# EAGLE schematic ESP32 SMD CH340G (EAGLE 9.6.2)
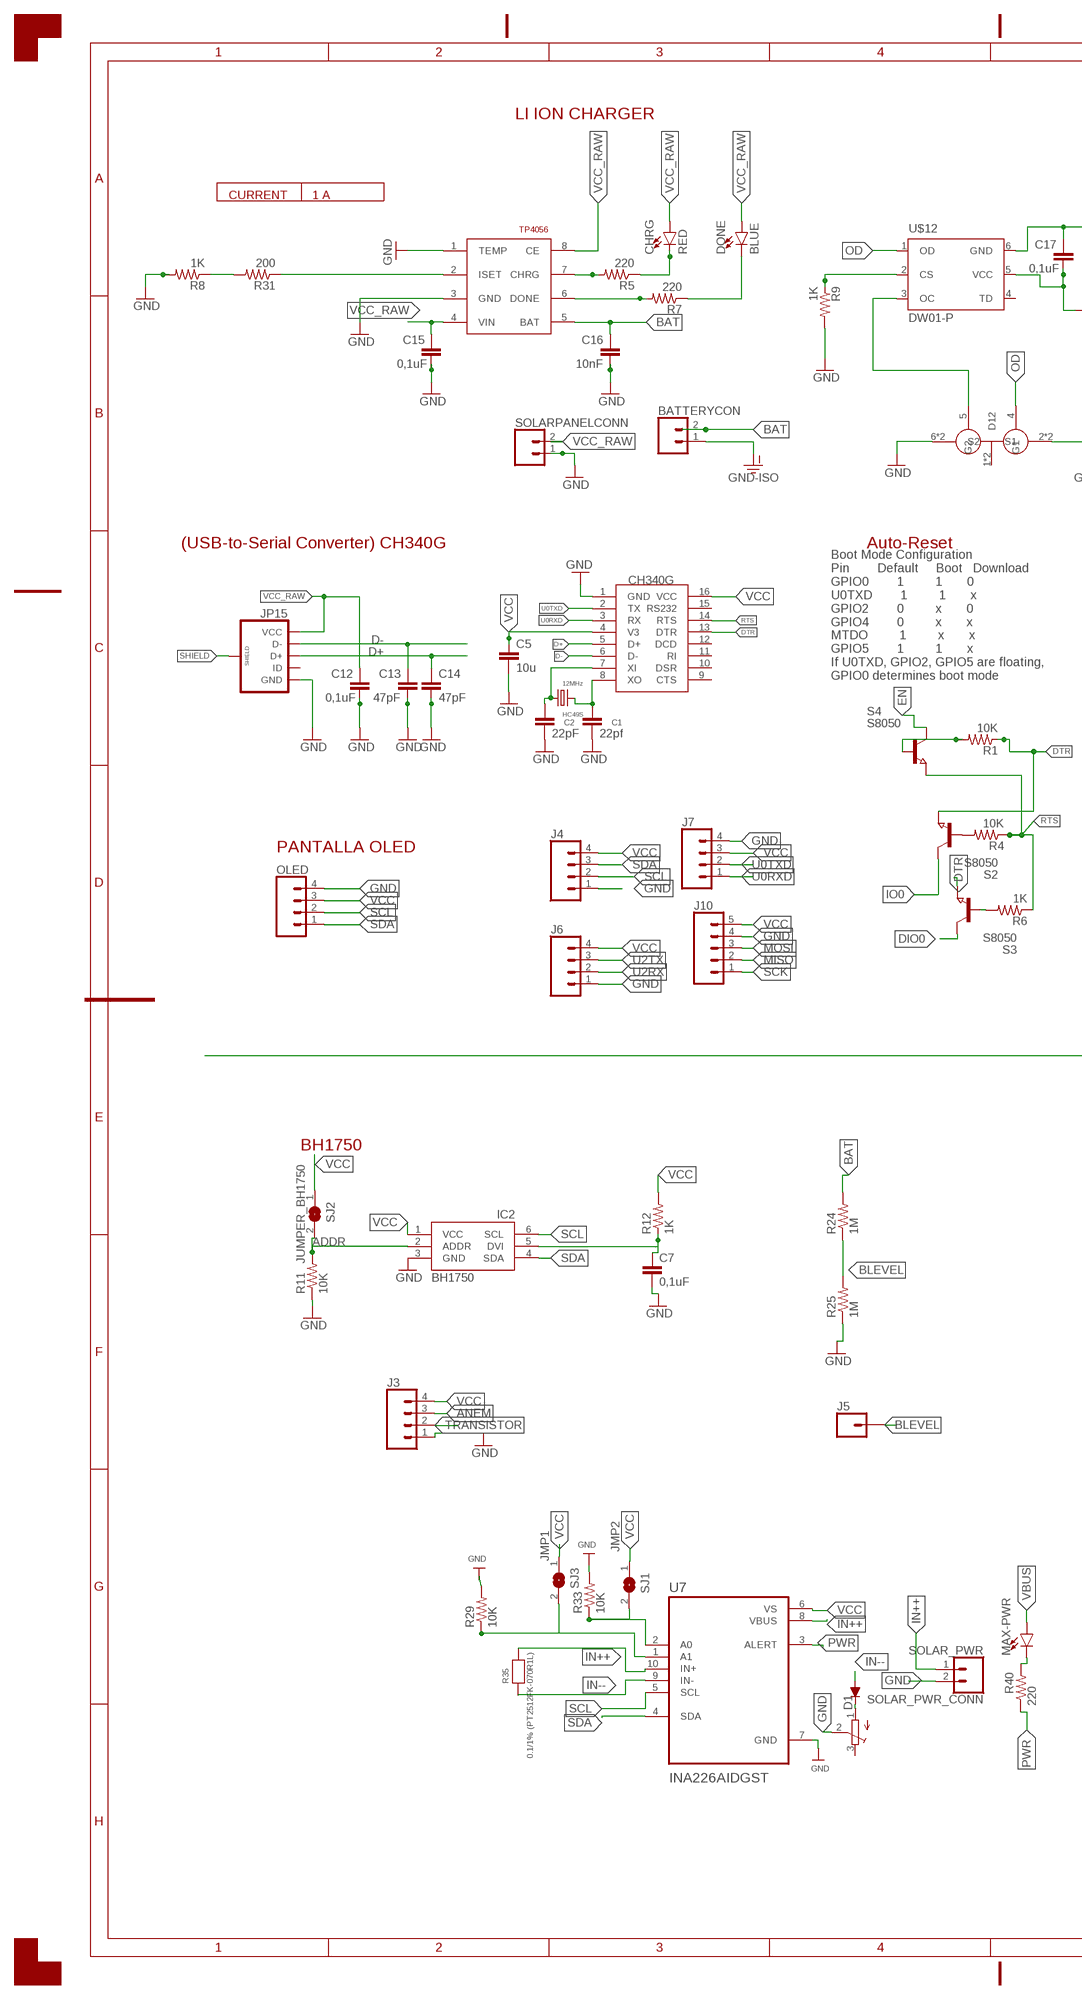
[diagram p0: schematic, sheet 1, part 1 of 2]
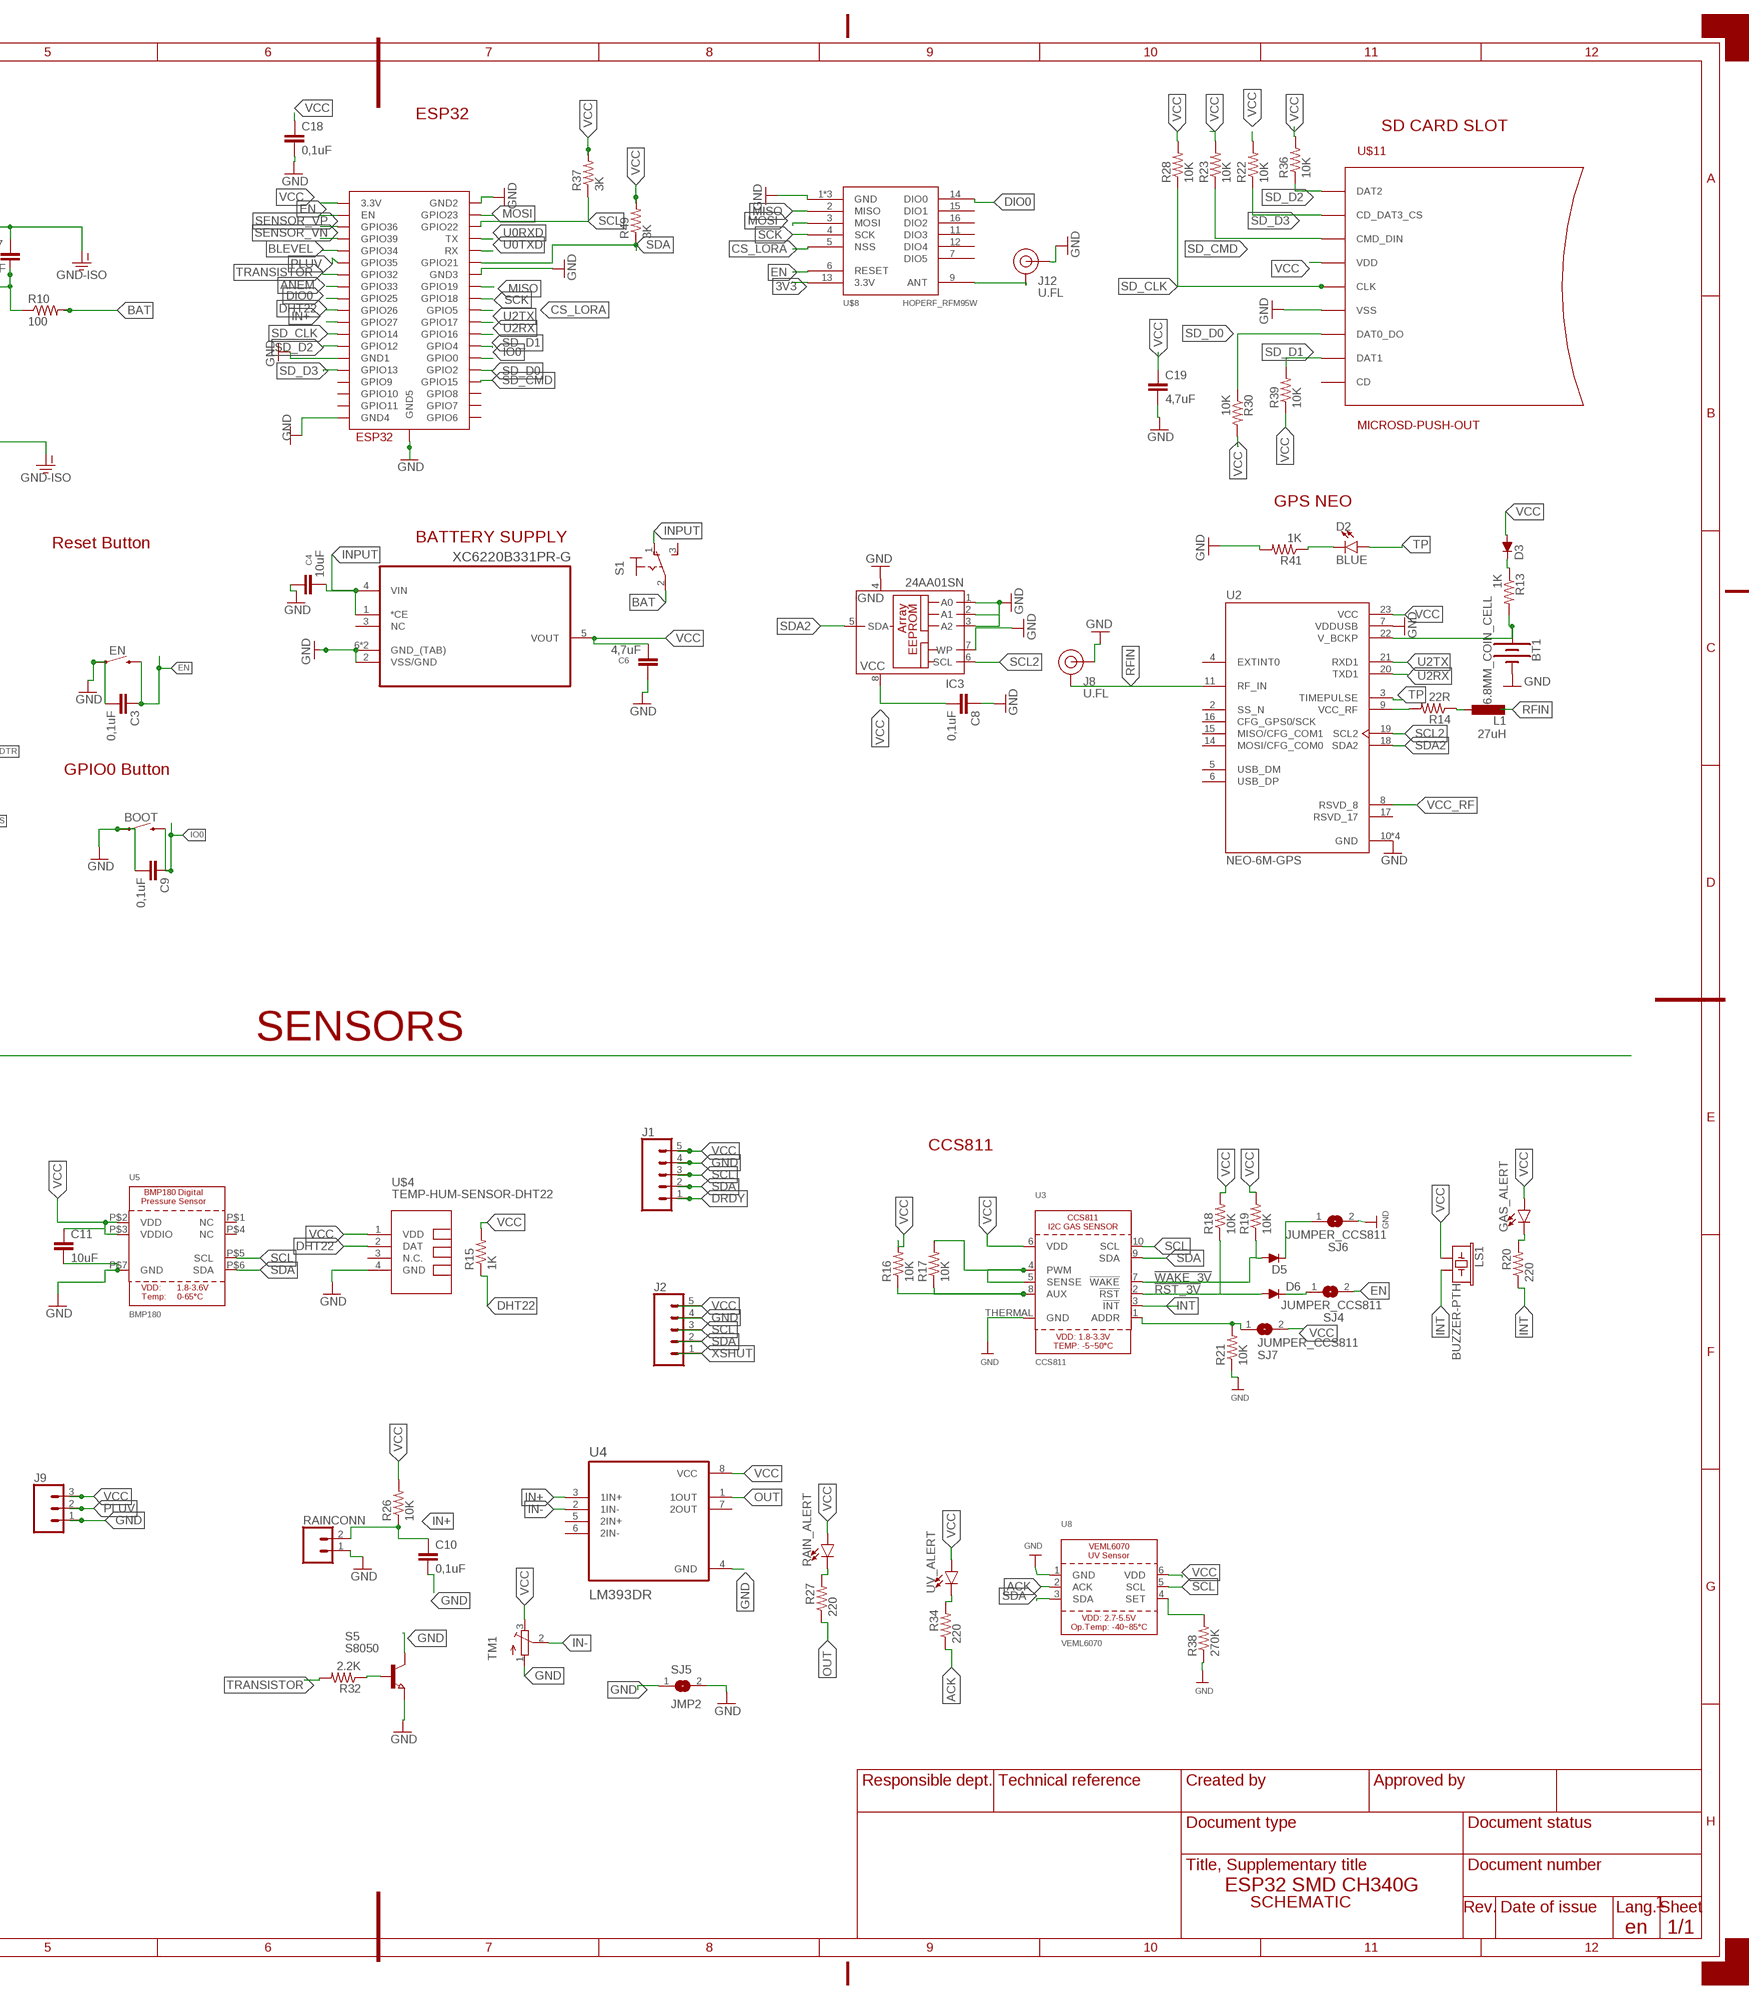
[diagram p1: schematic, sheet 1, part 2 of 2]
FRAME2 (A2_L_DOCFIELD_EN): LANGUAGE: en

## Parts
8205A  FS8205A  [TSSOP8]
BATTERYCON  CONN_02-JST-2-PTH-NO_SILK  [JST-2-PTH-NS]
BOOT  EN  MOMENTARY-SWITCH-SPST-SMD-6.0X3.5MM  [TACTILE_SWITCH_SMD_6.0X3.5MM]
BT1  6.8MM_COIN_CELL  BATTERY-6.8MM_SMD  [BATTCON-6.8MM]
C1  22pf  C-EUC0603  [C0603]
C2  22pF  C-EUC0603  [C0603]
C3  0,1uF  C-EUC0603  [C0603]
C4  10uF  C-EUC0603  [C0603]
C5  10u  C-EUC0603  [C0603]
C6  4,7uF  C-EUC0603  [C0603]
C7  0,1uF  C-EUC0603  [C0603]
C8  0,1uF  C-EUC0603  [C0603]
C9  0,1uF  C-EUC0603  [C0603]
C10  0,1uF  C-EUC0603  [C0603]
C11  10uF  C-EUC0603  [C0603]
C12  0,1uF  C-EUC0603  [C0603]
C13  47pF  C-EUC0603  [C0603]
C14  47pF  C-EUC0603  [C0603]
C15  0,1uF  C-EUC0603  [C0603]
C16  10nF  C-EUC0603  [C0603]
C17  0,1uF  C-EUC0603  [C0603]
C18  0,1uF  C-EUC0603  [C0603]
C19  4,7uF  C-EUC0603  [C0603]
CHRG  RED  LED-RED0603  [LED-0603]
D1  DIODE_DIODE-SOD123  [DIODE_SOD123]
D2  BLUE  LED-BLUE0603  [LED-0603]
D3  DIODE_DIODE-SOD123  [DIODE_SOD123]
D5  DIODE_DIODE-SOD123  [DIODE_SOD123]
D6  DIODE_DIODE-SOD123  [DIODE_SOD123]
DONE  BLUE  LED-BLUE0603  [LED-0603]
EN  RESET  MOMENTARY-SWITCH-SPST-SMD-6.0X3.5MM  [TACTILE_SWITCH_SMD_6.0X3.5MM]
GAS_ALERT  LED-3MM-NO_SILK  [LED_3MM-NS]
HC49S  12MHz  CRYSTALHC49S  [HC49/S]
IC2  BH1750  [WSOF-6]
IC3  24AA01SN  [SO-08]
J1  CONN_05JST-VERT  [JST-5-PTH-VERT]
J2  CONN_05JST-VERT  [JST-5-PTH-VERT]
J3  CONN_04JST-PTH-VERT  [JST-4-PTH-VERT]
J4  CONN_04  [1X04]
J5  CONN_01  [1X01]
J6  CONN_04  [1X04]
J7  CONN_04  [1X04]
J8  U.FL  U.FL2PIN  [U.FL]
J9  CONN_03JST-PTH-VERT  [JST-3-PTH-VERT]
J10  CONN_05JST-VERT  [JST-5-PTH-VERT]
J12  U.FL  U.FL2PIN  [U.FL]
JP15  USB_MICROB_PLUGCONN-11752  [USB-B-MICRO-SMD_V03]
L1  27uH  L-EUL3216C  [L3216C]
LS1  BUZZER-PTH  [BUZZER-12MM]
MAX-PWR  LED-3MM-NO_SILK  [LED_3MM-NS]
OLED  CONN_04  [1X04]
R1  10K  R-US_R0603  [R0603]
R4  10K  R-US_R0603  [R0603]
R5  220  R-US_R0603  [R0603]
R6  1K  R-US_R0603  [R0603]
R7  220  R-US_R0603  [R0603]
R8  1K  R-US_R0603  [R0603]
R9  1K  R-US_R0603  [R0603]
R10  100  R-US_R0603  [R0603]
R11  10K  R-US_R0603  [R0603]
R12  1K  R-US_R0603  [R0603]
R13  1K  R-US_R0603  [R0603]
R14  22R  R-US_R0603  [R0603]
R15  1K  R-US_R0603  [R0603]
R16  10K  R-US_R0603  [R0603]
R17  10K  R-US_R0603  [R0603]
R18  10K  R-US_R0603  [R0603]
R19  10K  R-US_R0603  [R0603]
R20  220  R-US_R0603  [R0603]
R21  10K  R-US_R0603  [R0603]
R22  10K  R-US_R0603  [R0603]
R23  10K  R-US_R0603  [R0603]
R24  1M  R-US_R0603  [R0603]
R25  1M  R-US_R0603  [R0603]
R26  10K  R-US_R0603  [R0603]
R27  220  R-US_R0603  [R0603]
R28  10K  R-US_R0603  [R0603]
R29  10K  R-US_R0603  [R0603]
R30  10K  R-US_R0603  [R0603]
R31  200  R-US_R0603  [R0603]
R32  2.2K  R-US_R0603  [R0603]
R33  10K  R-US_R0603  [R0603]
R34  220  R-US_R0603  [R0603]
R35  0.1/1% (PT2512FK-070R1L)  RESISTOR2512  [2512]
R36  10K  R-US_R0603  [R0603]
R37  3K  R-US_R0603  [R0603]
R38  270K  R-US_R0603  [R0603]
R39  10K  R-US_R0603  [R0603]
R40  220  R-US_R0603  [R0603]
R41  1K  R-US_R0603  [R0603]
R49  3K  R-US_R0603  [R0603]
RAIN_ALERT  LED-3MM-NO_SILK  [LED_3MM-NS]
RAINCONN  CONN_02-JST-2-PTH-NO_SILK  [JST-2-PTH-NS]
S1  320-916  [320-916]
S2  S8050  NPN-TRANSISTOR_SOT23  [SOT23]
S3  S8050  NPN-TRANSISTOR_SOT23  [SOT23]
S4  S8050  NPN-TRANSISTOR_SOT23  [SOT23]
S5  S8050  NPN-TRANSISTOR_SOT23  [SOT23]
SJ1  JMP2  SOLDERJUMPERREFLOW_NOPASTE  [SOLDERJUMPER_REFLOW_NOPASTE]
SJ2  JUMPER_BH1750  SOLDERJUMPERREFLOW_NOPASTE  [SOLDERJUMPER_REFLOW_NOPASTE]
SJ3  JMP1  SOLDERJUMPERREFLOW_NOPASTE  [SOLDERJUMPER_REFLOW_NOPASTE]
SJ4  JUMPER_CCS811  SOLDERJUMPERREFLOW_NOPASTE  [SOLDERJUMPER_REFLOW_NOPASTE]
SJ5  JMP2  SOLDERJUMPERREFLOW_NOPASTE  [SOLDERJUMPER_REFLOW_NOPASTE]
SJ6  JUMPER_CCS811  SOLDERJUMPERREFLOW_NOPASTE  [SOLDERJUMPER_REFLOW_NOPASTE]
SJ7  JUMPER_CCS811  SOLDERJUMPERREFLOW_NOPASTE  [SOLDERJUMPER_REFLOW_NOPASTE]
SOLAR_PWR_CONN  SOLAR_PWR  CONN_02-JST-2-PTH-NO_SILK  [JST-2-PTH-NS]
SOLARPANELCONN  CONN_02-JST-2-PTH-NO_SILK  [JST-2-PTH-NS]
TM1  TRIMPOTTC33X  [TC33X]
TM2  TRIMPOTTC33X  [TC33X]
TP4056  DIO5158  [SOIC-8]
U1  CH340G  [SOIC16]
U2  NEO-6M-GPS  [XCVR_NEO-6M-GPS]
U3  CCS811  [CCS811]
U4  LM393DR  [SOIC127P599X175-8N]
U5  BMP180  BMP180EXT  [BMP180_EXTENDED]
U7  INA226AIDGST  [SOP50P490X110-10N]
U8  VEML6070  UV_VEML6070  [VEML6070]
U$1  ESP32-WROOM  [ESP32-WROOM]
U$4  TEMP-HUM-SENSOR-DHT22  [TEMP-HUM-SENSOR-DHT22]
U$8  HOPERF_RFM95W  [HOPERF_RFM95W]
U$11  MICROSD-PUSH-OUT  [MICROSD-PUSH-OUT]
U$12  DW01-P  [SOT23-6L]
UV_ALERT  LED-3MM-NO_SILK  [LED_3MM-NS]
XC6220B331PR-G  XC6210B332PR  [XC6210B332PR]

## Nets
3V3: U$8.13(3.3V)
!RST_3V: D6.A R18.1 U3.2(!RST)
!WAKE_3V: D5.A R19.1 U3.7(!WAKE)
ACK: R34.1 U8.2(ACK)
ADDR: IC2.2(ADDR) R11.2 SJ2.2
ANEM: J3.3 U$1.IO33(GPIO33)
BAT: BATTERYCON.2 C16.1 R10.2 R24.2 S1.2(P) TP4056.5(BAT)
BLEVEL: J5.1 R24.1 R25.2 U$1.IO34(GPIO34)
CHRG: R5.2 TP4056.7(CHRG)
CS_LORA: U$1.IO5(GPIO5) U$8.5(NSS)
D+: C14.1 JP15.D+ U1.5(D+)
D-: C13.1 JP15.D- U1.6(D-)
DHT22: R15.1 U$1.IO26(GPIO26) U$4.2(DAT)
DIO0: S3.3(C) U$1.IO25(GPIO25) U$8.14(DIO0)
DONE: R7.2 TP4056.6(DONE)
DRDY: J1.1
DTR: R1.1 S2.2(E) S3.2(E) U1.13(DTR)
EN: C3.1 EN.2 S4.3(C) SJ4.2 U$1.EN U$8.6(RESET)
GND [GND]: 8205A.6(S2) 8205A.7(S2) BOOT.1 BT1.- C1.2 C2.2 C3.2 C4.1 C5.2 C6.1 C7.2 C8.1 C9.2 C10.2 C11.2 C12.2 C13.2 C14.2 C15.2 C16.2 C18.2 C19.2 EN.1 IC2.3(GND) IC3.1(A0) IC3.2(A1) IC3.3(A2) IC3.4(GND) IC3.7(WP) J1.4 J2.4 J3.1 J4.1 J6.1 J7.4 J8.FEED(SIGNAL) J9.1 J10.4 J12.FEED(SIGNAL) JP15.GND OLED.4 R8.2 R9.2 R11.1 R21.1 R25.1 R29.2 R33.2 R38.1 R41.2 RAINCONN.1 S5.2(E) S5.3(C) SJ5.1 SJ5.2 SJ6.2 SOLAR_PWR_CONN.2 SOLARPANELCONN.1 TM1.1(A) TM2.2(S) TP4056.1(TEMP) TP4056.3(GND) U1.1(GND) U2.7(VDDUSB) U2.10(GND) U2.12(GND) U2.13(GND) U2.24(GND) U3.THERMAL(GND) U4.4(GND) U5.P$7(GND) U7.7(GND) U8.1(GND) U$1.GND1 U$1.GND2 U$1.GND3 U$1.GND4 U$1.GND5 U$4.4(GND) U$8.1(GND) U$8.8(GND) U$8.10(GND) U$11.6(VSS) U$11.G1(VSS) U$11.G2(VSS) U$11.G3(VSS) U$11.G4(VSS) XC6220B331PR-G.2(VSS/GND) XC6220B331PR-G.6(GND_(TAB)) XC6220B331PR-G.TAB(GND_(TAB))
GND-ISO: 8205A.2(S1) 8205A.3(S1) BATTERYCON.1 C17.1 U$12.6(GND)
IN+: C10.1 R26.1 RAINCONN.2 U4.3(1IN+) U$1.IO27(GPIO27)
IN++: R35.2 SOLAR_PWR_CONN.1 U7.8(VBUS) U7.10(IN+)
IN-: TM1.2(S) U4.2(1IN-)
IN--: D1.A R35.1 U7.9(IN-)
INPUT: C4.2 S1.1(O) XC6220B331PR-G.1(*CE) XC6220B331PR-G.4(VIN)
INT: LS1.- R20.1 U3.3(!INT)
IO0: BOOT.2 C9.1 S2.3(C) U$1.IO0(GPIO0)
ISET: R31.1 TP4056.2(ISET)
LED1: CHRG.C R5.1
LED2: DONE.C R7.1
MISO: J10.2 U$1.IO19(GPIO19) U$8.2(MISO)
MOSI: J10.3 U$1.IO23(GPIO23) U$8.3(MOSI)
N$1: C1.1 HC49S.2 U1.8(XO)
N$2: C2.1 HC49S.1 U1.7(XI)
N$3: R4.2 S2.1(B)
N$4: R14.2 U2.9(VCC_RF)
N$5: R1.2 S4.1(B)
N$6: L1.1 R14.1
N$8: D3.C R13.1
N$9: R16.1 R17.1 U3.8(AUX)
N$10: GAS_ALERT.K(C) R20.2
N$11: R21.2 SJ7.1 U3.1(ADDR)
N$12: R27.2 RAIN_ALERT.K(C)
N$14: R6.2 S3.1(B)
N$15: D5.C SJ6.1
N$16: D6.C SJ4.1
N$17: R38.2 U8.4(SET)
N$18: D1.C TM2.1(A)
N$19: R33.1 SJ1.2 U7.2(A0)
N$20: R29.1 SJ3.2 U7.1(A1)
N$21: R34.2 UV_ALERT.K(C)
N$22: R8.1 R31.2
N$23: R32.1 S5.1(B)
N$24: MAX-PWR.K(C) R40.2
N$25: D2.C R41.1
N$26: J12.1(GND) J12.2(GND) U$8.9(ANT)
N$75: BT1.+ R13.2 U2.22(V_BCKP)
N$97: C7.1 IC2.5(DVI) R12.1
N$98: R17.2 U3.4(PWM) U3.5(SENSE)
N$104: R9.1 U$12.2(CS)
N$105: 8205A.5(G2) U$12.3(OC)
OD: 8205A.4(G1) U$12.1(OD)
OUT: R27.1 U4.1(1OUT)
PLUV: J9.2 U$1.IO35(GPIO35)
PWR: R40.1 U7.3(ALERT)
RFIN: J8.1(GND) J8.2(GND) L1.2 U2.11(RF_IN)
RTS: R4.1 R6.1 S4.2(E) U1.14(RTS)
SCK: J10.1 U$1.IO18(GPIO18) U$8.4(SCK)
SCL: IC2.6(SCL) J1.3 J2.3 J4.2 OLED.2 R37.1 U3.10(SCL) U5.P$5(SCL) U7.5(SCL) U8.5(SCL) U$1.IO22(GPIO22)
SCL2: IC3.6(SCL) U2.19(SCL2)
SD_CLK: R28.1 U$1.IO14(GPIO14) U$11.5(CLK)
SD_CMD: R23.1 U$1.IO15(GPIO15) U$11.3(CMD_DIN)
SD_D0: R30.1 U$1.IO2(GPIO2) U$11.7(DAT0_DO)
SD_D1: R39.2 U$1.IO4(GPIO4) U$11.8(DAT1)
SD_D2: R36.1 U$1.IO12(GPIO12) U$11.1(DAT2)
SD_D3: R22.1 U$1.IO13(GPIO13) U$11.2(CD_DAT3_CS)
SDA: IC2.4(SDA) J1.2 J2.2 J4.3 OLED.1 R49.1 U3.9(SDA) U5.P$6(SDA) U7.4(SDA) U8.3(SDA) U$1.IO21(GPIO21)
SDA2: IC3.5(SDA) U2.18(SDA2)
SENSOR_VN: U$1.SENSOR_VN(GPIO39)
SENSOR_VP: U$1.SENSOR_VP(GPIO36)
SHIELD: JP15.SHIELD1(SHIELD) JP15.SHIELD2(SHIELD) JP15.SHIELD3(SHIELD)
TP: D2.A U2.3(TIMEPULSE)
TRANSISTOR: J3.2 R32.2 U$1.IO32(GPIO32)
U0RXD: J7.1 U1.3(RX) U$1.TX
U0TXD: J7.2 U1.2(TX) U$1.RX
U2RX: J6.2 U2.20(TXD1) U$1.IO16(GPIO16)
U2TX: J6.3 U2.21(RXD1) U$1.IO17(GPIO17)
VBUS: MAX-PWR.A
VCC: C5.1 C6.2 C8.2 C11.1 C18.1 C19.1 D3.A GAS_ALERT.A IC2.1(VCC) IC3.8(VCC) J1.5 J2.5 J3.4 J4.4 J6.4 J7.3 J9.3 J10.5 LS1.+ OLED.3 R12.2 R15.2 R16.2 R18.2 R19.2 R22.2 R23.2 R26.2 R28.2 R30.2 R36.2 R37.2 R39.1 R49.2 RAIN_ALERT.A SJ1.1 SJ2.1 SJ3.1 SJ7.2 TM1.3(E) U1.4(V3) U1.16(VCC) U2.23(VCC) U3.6(VDD) U4.8(VCC) U5.P$2(VDD) U5.P$3(VDDIO) U7.6(VS) U8.6(VDD) U$1.3V3(3.3V) U$4.1(VDD) U$11.4(VDD) UV_ALERT.A XC6220B331PR-G.5(VOUT)
VCC-DW: C17.2 R10.1 U$12.5(VCC)
VCC_RAW: C12.1 C15.1 CHRG.A DONE.A JP15.VBUS(VCC) SOLARPANELCONN.2 TP4056.4(VIN) TP4056.8(CE)
VCC_RF: U2.8(RSVD_8)
XSHUT: J2.1
Unconnected: 8205A.1(D12) 8205A.8(D12) JP15.ID S1.3(S) TM2.3(E) U1.9(CTS) U1.10(DSR) U1.11(RI) U1.12(DCD) U1.15(RS232) U2.2(SS_N) U2.4(EXTINT0) U2.5(USB_DM) U2.6(USB_DP) U2.14(MOSI/CFG_COM0) U2.15(MISO/CFG_COM1) U2.16(CFG_GPS0/SCK) U2.17(RSVD_17) U4.5(2IN+) U4.6(2IN-) U4.7(2OUT) U5.P$1(NC) U5.P$4(NC) U$1.CLK(GPIO6) U$1.CMD(GPIO11) U$1.SD0(GPIO7) U$1.SD1(GPIO8) U$1.SD2(GPIO9) U$1.SD3(GPIO10) U$4.3(N.C.) U$8.7(DIO5) U$8.11(DIO3) U$8.12(DIO4) U$8.15(DIO1) U$8.16(DIO2) U$11.CD U$12.4(TD) XC6220B331PR-G.3(NC)

## Notes on the sheet
- LI ION CHARGER | ESP32
- SD CARD SLOT
- CURRENT | 1 A
- GPS NEO
- BATTERY SUPPLY
- (USB-to-Serial Converter) CH340G | Auto-Reset | Reset Button
- Boot Mode Configuration
  Pin        Default     Boot   Download
  GPIO0        1         1       0
  U0TXD        1         1       x
  GPIO2        0         x       0
  GPIO4        0         x       x
  MTDO         1         x       x
  GPIO5        1         1       x
  If U0TXD, GPIO2, GPIO5 are floating, 
  GPIO0 determines boot mode
- GPIO0 Button
- PANTALLA OLED
- SENSORS
- BH1750 | CCS811
- SCHEMATIC | 1

## Library data of the parts
8205A = SparkFun:FS8205A
BATTERYCON RAINCONN SOLAR_PWR_CONN SOLARPANELCONN = SparkFun-Connectors:CONN_02: Multi connection point. Often used as Generic Header-pin footprint for 0.1 inch spaced/style header connections On any of the 0.1 inch spaced packages, you can populate with these: Break Away Headers - Straight <https://www.sparkfun.com/products/116> (PRT-00116) Break Away Male Headers - Right Angle <https://www.sparkfun.com/products/553> (PRT-00553) Female Headers <https://www.sparkfun.com/products/115> (PRT-00115) Break Away Headers - Machine Pin <https://www.sparkfun.com/products/117> (PRT-00117) Break Away Female Headers - Swiss Machine Pin <https://www.sparkfun.com/products/743> (PRT-00743) For SCREWTERMINALS and SPRING TERMINALS visit here: Screw Terimnals on SparkFun.com <https://www.sparkfun.com/search/results?term=Screw+Terminals> (5mm/3.5mm/2.54mm spacing) This device is also useful as a general connection point to wire up your design to another part of your project. Our various solder wires solder well into these plated through hole pads. Hook-Up Wire - Assortment (Stranded, 22 AWG) <https://www.sparkfun.com/products/11375> (PRT-11375) Hook-Up Wire - Assortment (Solid Core, 22 AWG) <https://www.sparkfun.com/products/11367> (PRT-11367) View the entire wire category on our website here <https://www.sparkfun.com/categories/141> Special notes: Molex polarized connector foot print use with: PRT-08233 with associated crimp pins and housings. 2.54_SCREWTERM for use with PRT-10571. 3.5mm Screw Terminal footprints for PRT-08084 5mm Screw Terminal footprints for use with PRT-08432
BOOT EN = SparkFun-Switches:MOMENTARY-SWITCH-SPST: Momentary Switch (Pushbutton) - SPST Normally-open (NO) SPST momentary switches (buttons, pushbuttons). Variants PTH-12MM - 12mm square, through-hole Momentary Pushbutton Switch - 12mm Square <https://www.sparkfun.com/products/9190> (COM-09190) PTH-6.0MM, PTH-6.0MM-KIT - 6.0mm square, through-hole Mini Pushbutton Switch <https://www.sparkfun.com/products/97> (COM-00097) KIT package intended for soldering kit's - only one side of pads' copper is exposed. PTH-RIGHT-ANGLE-KIT - Right-angle, through-hole Right Angle Tactile Button <https://www.sparkfun.com/products/10791> - Used on SparkFun BigTime Watch Kit <https://www.sparkfun.com/products/11734> SMD-12MM - 12mm square, surface-mount Tactile Button - SMD (12mm) <https://www.sparkfun.com/products/12993> (COM-12993) Used on SparkFun PicoBoard <https://www.sparkfun.com/products/11888> SMD-4.5MM - 4.5mm Square Trackball Switch Used on SparkFun Blackberry Trackballer Breakout <https://www.sparkfun.com/products/13169> SMD-4.6MMX2.8MM - 4.60mm x 2.80mm, surface mount Used on SparkFun SAMD21 Mini Breakout <https://www.sparkfun.com/products/13664> SMD-5.2MM, SMD-5.2-REDUNDANT - 5.2mm square, surface-mount Mini Pushbutton Switch - SMD <https://www.sparkfun.com/products/8720> (COM-08720) Used on Arduino Pro Mini <https://www.sparkfun.com/products/11114> REDUNDANT package connects both switch circuits together SMD-6.0X3.5MM - 6.0 x 3.5mm, surface mount Momentary Reset Switch SMD <https://www.sparkfun.com/products/8229> (COM-08229) SMD-6.2MM-TALL - 6.2mm square, surface mount Tactile Button - SMD (6mm) <https://www.sparkfun.com/products/12992> Used on SparkFun Digital Sandbox <https://www.sparkfun.com/products/12651> SMD-RIGHT-ANGLE - Right-angle, surface mount Used on SparkFun Block for Intel® Edison - Arduino <https://www.sparkfun.com/products/13036>; PROD_ID: SWCH-00815; SF_SKU: COM-08229
BT1 = SparkFun-Batteries:BATTERY: Battery - Single Cell A variety of battery chemistries, sizes, and footprints. Device List: 20MM_PTH - Coin Cell Battery Holder - 20mm (PTH) <https://www.sparkfun.com/products/783> 6.8MM_PTH - Coin Cell Battery Holder - 6.8MM(SMD) <https://www.digikey.com/product-detail/en/seiko-instruments/MS621FE-FL11E/728-1057-ND/1889208?WT.srch=1&gclid=CNOQ5a6LzdQCFZS2wAodXCkE0g> 12MM_SMD - Coin Cell Battery Holder - 12mm (SMD) <https://www.sparkfun.com/products/10592> 12MM_PTH - Coin Cell Battery Holder - 12mm (PTH) <https://www.sparkfun.com/products/7948> 20MM_SMD - 20mm Coin Cell Battery Holder (SMD) (2 legs) Used on the Big Time Watch Kit <https://www.sparkfun.com/products/11734> 20MM_SMD_4LEGS - Coin Cell Battery Holder - 20mm (SMD) <https://www.sparkfun.com/products/11892> 20MM_SMD_4LEGS_OVERPASTE - Coin Cell Battery Holder - 20mm (SMD) <https://www.sparkfun.com/products/11892> (Over-paste on the legs) 24.5MM_PTH - Coin Cell Battery Holder - 24.5mm (PTH) <https://www.sparkfun.com/products/8863> 9V - 9V Battery Holder - PC Mount Used on the SparkFun SparkPunk Sound Kit <https://www.sparkfun.com/products/11177> and SparkFun SparkPunk Sequencer Kit <https://www.sparkfun.com/products/12707> 18650 - Battery Holder - 18650 (PTH) <https://www.sparkfun.com/products/13113> AA - Battery Holder - 1xAA (PTH) <https://www.sparkfun.com/products/7949> AAA - Battery Holder - 1xAAA (PTH) <https://www.sparkfun.com/products/12718> AA_KIT - Battery Holder - 1xAA (PTH) <https://www.sparkfun.com/products/7949> Special kit package - pads only have exposed copper on one side of the board. AAA_KIT - Battery Holder - 1xAAA (PTH) <https://www.sparkfun.com/products/12718> Special kit package - pads only have exposed copper on one side of the board.; PROD_ID: BATT-13734
C1-C19 = rcl:C-EU: CAPACITOR, European symbol; SPICEPREFIX: C
CHRG = SparkFun-LED:LED-RED: Red SMD LED Used in manufacturing of most products at SparkFun Packages: 0603 - SMD 0603 package [Product Link] <http://docs.avagotech.com/docs/AV02-0551EN> 0603 SMART - SMD 0603 SMART package ( more efficient and expensive)[Product Link] <http://www.osram-os.com/Graphics/XPic2/00077099_0.pdf> 1206 - SMD1206 package [Product Link] <https://www.sparkfun.com/datasheets/DevTools/LilyPad/Q150OVS4.pdff> SparkFun Products: Pro Mini 328 -5V <https://www.sparkfun.com/products/821> RedBoard <https://www.sparkfun.com/products/12757> IOIO-OTG <https://www.sparkfun.com/products/13613>; PROD_ID: DIO-00819
D1 D3 D5 D6 = 52101-101-REV-A:DIODE_DIODE-: DIODE
D2 DONE = SparkFun-LED:LED-BLUE: Blue SMD LED Used in manufacturing of various products at SparkFun Packages: 0603 - SMD 0603 package [Product Link] <http://www.digikey.com/product-detail/en/SMLE12BC7TT86/511-1589-2-ND/1641808> 1206 - SMD1206 package [Product Link] <http://www.digikey.com/product-detail/en/lite-on-inc/LTST-C150TBKT/160-1643-1-ND/573584> SparkFun Products: ESP8266 Thing-Dev Board <https://www.sparkfun.com/products/13711> RedBoard <https://www.sparkfun.com/products/12757>; PROD_ID: DIO-08575
GAS_ALERT MAX-PWR RAIN_ALERT UV_ALERT = SparkFun-LED:LED: LED (Generic) Standard schematic elements and footprints for 5mm, 3mm, 1206, and 0603 sized LEDs. Generic LEDs with no color specified.
HC49S = crystal:CRYSTAL: CRYSTAL; OC_FARNELL: 1667008; OC_NEWARK: unknown
IC2 = microbuilder:BH1750
IC3 = microchip:24*: Serial EEPROM I2C; MF: MICROCHIP; MPN: 24AA01/SN; OC_FARNELL: 1331268; OC_NEWARK: 89C9792
J1 J2 J10 = SparkFun-Connectors:CONN_05: Multi connection point. Often used as Generic Header-pin footprint for 0.1 inch spaced/style header connections On any of the 0.1 inch spaced packages, you can populate with these: Break Away Headers - Straight <https://www.sparkfun.com/products/116> (PRT-00116) Break Away Male Headers - Right Angle <https://www.sparkfun.com/products/553> (PRT-00553) Female Headers <https://www.sparkfun.com/products/115> (PRT-00115) Break Away Headers - Machine Pin <https://www.sparkfun.com/products/117> (PRT-00117) Break Away Female Headers - Swiss Machine Pin <https://www.sparkfun.com/products/743> (PRT-00743) For SCREWTERMINALS and SPRING TERMINALS visit here: Screw Terimnals on SparkFun.com <https://www.sparkfun.com/search/results?term=Screw+Terminals> (5mm/3.5mm/2.54mm spacing) This device is also useful as a general connection point to wire up your design to another part of your project. Our various solder wires solder well into these plated through hole pads. Hook-Up Wire - Assortment (Stranded, 22 AWG) <https://www.sparkfun.com/products/11375> (PRT-11375) Hook-Up Wire - Assortment (Solid Core, 22 AWG) <https://www.sparkfun.com/products/11367> (PRT-11367) View the entire wire category on our website here <https://www.sparkfun.com/categories/141> Special notes: Molex polarized connector foot print use with SKU : PRT-08231 with associated crimp pins and housings. 1MM SMD Version SKU: PRT-10208
J3 = SparkFun-Connectors:CONN_04: Multi connection point. Often used as Generic Header-pin footprint for 0.1 inch spaced/style header connections On any of the 0.1 inch spaced packages, you can populate with these: Break Away Headers - Straight <https://www.sparkfun.com/products/116> (PRT-00116) Break Away Male Headers - Right Angle <https://www.sparkfun.com/products/553> (PRT-00553) Female Headers <https://www.sparkfun.com/products/115> (PRT-00115) Break Away Headers - Machine Pin <https://www.sparkfun.com/products/117> (PRT-00117) Break Away Female Headers - Swiss Machine Pin <https://www.sparkfun.com/products/743> (PRT-00743) For SCREWTERMINALS and SPRING TERMINALS visit here: Screw Terimnals on SparkFun.com <https://www.sparkfun.com/search/results?term=Screw+Terminals> (5mm/3.5mm/2.54mm spacing) This device is also useful as a general connection point to wire up your design to another part of your project. Our various solder wires solder well into these plated through hole pads. Hook-Up Wire - Assortment (Stranded, 22 AWG) <https://www.sparkfun.com/products/11375> (PRT-11375) Hook-Up Wire - Assortment (Solid Core, 22 AWG) <https://www.sparkfun.com/products/11367> (PRT-11367) View the entire wire category on our website here <https://www.sparkfun.com/categories/141> Special notes: Molex polarized connector foot print use with SKU : PRT-08231 with associated crimp pins and housings. 1MM SMD Version SKU: PRT-10208; PROD_ID: CONN-13251
J4 J6 J7 OLED = SparkFun-Connectors:CONN_04: Multi connection point. Often used as Generic Header-pin footprint for 0.1 inch spaced/style header connections On any of the 0.1 inch spaced packages, you can populate with these: Break Away Headers - Straight <https://www.sparkfun.com/products/116> (PRT-00116) Break Away Male Headers - Right Angle <https://www.sparkfun.com/products/553> (PRT-00553) Female Headers <https://www.sparkfun.com/products/115> (PRT-00115) Break Away Headers - Machine Pin <https://www.sparkfun.com/products/117> (PRT-00117) Break Away Female Headers - Swiss Machine Pin <https://www.sparkfun.com/products/743> (PRT-00743) For SCREWTERMINALS and SPRING TERMINALS visit here: Screw Terimnals on SparkFun.com <https://www.sparkfun.com/search/results?term=Screw+Terminals> (5mm/3.5mm/2.54mm spacing) This device is also useful as a general connection point to wire up your design to another part of your project. Our various solder wires solder well into these plated through hole pads. Hook-Up Wire - Assortment (Stranded, 22 AWG) <https://www.sparkfun.com/products/11375> (PRT-11375) Hook-Up Wire - Assortment (Solid Core, 22 AWG) <https://www.sparkfun.com/products/11367> (PRT-11367) View the entire wire category on our website here <https://www.sparkfun.com/categories/141> Special notes: Molex polarized connector foot print use with SKU : PRT-08231 with associated crimp pins and housings. 1MM SMD Version SKU: PRT-10208; PROD_ID: CONN-09696
J5 = SparkFun-Connectors:CONN_01: Single connection point. Often used as Generic Header-pin footprint for 0.1 inch spaced/style header connections On any of the 0.1 inch spaced packages, you can populate with these: Break Away Headers - Straight <https://www.sparkfun.com/products/116> (PRT-00116) Break Away Male Headers - Right Angle <https://www.sparkfun.com/products/553> (PRT-00553) Female Headers <https://www.sparkfun.com/products/115> (PRT-00115) Break Away Headers - Machine Pin <https://www.sparkfun.com/products/117> (PRT-00117) Break Away Female Headers - Swiss Machine Pin <https://www.sparkfun.com/products/743> (PRT-00743) This device is also useful as a general connection point to wire up your design to another part of your project. Our various solder wires solder well into these plated through hole pads. Hook-Up Wire - Assortment (Stranded, 22 AWG) <https://www.sparkfun.com/products/11375> (PRT-11375) Hook-Up Wire - Assortment (Solid Core, 22 AWG) <https://www.sparkfun.com/products/11367> (PRT-11367) View the entire wire category on our website here <https://www.sparkfun.com/categories/141> Special notes: SMTSO-256-ET is a "flush mount" nut for a 4-40 screw. We mostly use this on specialty testbeds; it is a nice way to connect hardware to your PCB at an adjustable hieght. Also note, the SNAP packages are for using a snappable style connector. We sell a baggie of snaps and they are also used on two LilyPad designs: Snap Assortment - 30 pack (male and female) <https://www.sparkfun.com/products/11347> (DEV-11347) LilyPad Arduino SimpleSnap <https://www.sparkfun.com/products/10941> (DEV-10941) LilyPad SimpleSnap Protoboard <https://www.sparkfun.com/products/10940> (DEV-10940)
J8 J12 = SparkFun-Connectors:U.FL2PIN: SMD Antenna Connector - U.FL 2mm height, 3.0mm x 3.0mm receptacle size. SparkFun Products: SparkFun WiFi Shield - ESP8266 <https://www.sparkfun.com/products/13287> SparkFun ESP8266 Thing <https://www.sparkfun.com/products/13231> SparkFun MiniGen - Pro Mini Signal Generator Shield <https://www.sparkfun.com/products/11420>; PROD_ID: CONN-09193; SF_ID: WRL-09144
J9 = SparkFun-Connectors:CONN_03: Multi connection point. Often used as Generic Header-pin footprint for 0.1 inch spaced/style header connections On any of the 0.1 inch spaced packages, you can populate with these: Break Away Headers - Straight <https://www.sparkfun.com/products/116> (PRT-00116) Break Away Male Headers - Right Angle <https://www.sparkfun.com/products/553> (PRT-00553) Female Headers <https://www.sparkfun.com/products/115> (PRT-00115) Break Away Headers - Machine Pin <https://www.sparkfun.com/products/117> (PRT-00117) Break Away Female Headers - Swiss Machine Pin <https://www.sparkfun.com/products/743> (PRT-00743) Stackable Header - 3 Pin (Female, 0.1") <https://www.sparkfun.com/products/13875> (PRT-13875) For SCREWTERMINALS and SPRING TERMINALS visit here: Screw Terimnals on SparkFun.com <https://www.sparkfun.com/search/results?term=Screw+Terminals> (5mm/3.5mm/2.54mm spacing) This device is also useful as a general connection point to wire up your design to another part of your project. Our various solder wires solder well into these plated through hole pads. Hook-Up Wire - Assortment (Stranded, 22 AWG) <https://www.sparkfun.com/products/11375> (PRT-11375) Hook-Up Wire - Assortment (Solid Core, 22 AWG) <https://www.sparkfun.com/products/11367> (PRT-11367) View the entire wire category on our website here <https://www.sparkfun.com/categories/141> Special notes: Molex polarized connector foot print use with SKU : PRT-08232 with associated crimp pins and housings.; PROD_ID: CONN-13230
JP15 = SparkFun-Connectors:USB_MICROB_PLUG: USB Micro-B connectors Some male, some female. Watch your step!; PROD_ID: CONN-11752
L1 = rcl:L-EU: INDUCTOR, European symbol; SPICEPREFIX: L
LS1 = SparkFun-Electromechanical:BUZZER: Buzzer Small round buzzers that operate around the audible 2kHz range. You can use these as speakers to create simple music or user interfaces. Variant Overview: PTH - Mini Speaker - PC Mount 12mm 2.048kHz <https://www.sparkfun.com/products/7950> PTH_KIT - Mini Speaker - PC Mount 12mm 2.048kHz <https://www.sparkfun.com/products/7950> KIT simplifies soldering by adding stop mask to one side of the pads. PTH_NO_SILK - Mini Speaker - PC Mount 12mm 2.048kHz <https://www.sparkfun.com/products/7950> No silkscreen indicator of buzzer outline. PTH_KIT_NO_SILK - Mini Speaker - PC Mount 12mm 2.048kHz <https://www.sparkfun.com/products/7950> KIT package w/o silkscreen SMD - Buzzer Audio Magnetic (CCV-084B16) SMD buzzer used on, e.g. the LilyPad Buzzer <https://www.sparkfun.com/products/8463> and RFID USB Reader <https://www.sparkfun.com/products/9963>. SMD_KIT - Buzzer Audio Magnetic (CCV-084B16) SMD Buzzer with elongated pins to make soldering easier. Used on the SparkFun Simon Says - Surface Mount Soldering Kit <https://www.sparkfun.com/products/10935>.; PROD_ID: COMP-08253; SF_SKU: COM-07950
R1 R4-R34 R36-R41 R49 = rcl:R-US_: RESISTOR, American symbol; SPICEPREFIX: R
R35 = microbuilder:RESISTOR: Resistors For new designs, use the packages preceded by an '_' character since they are more reliable: The following footprints should be used on most boards: _0402 - Standard footprint for regular board layouts _0603 - Standard footprint for regular board layouts _0805 - Standard footprint for regular board layouts _1206 - Standard footprint for regular board layouts For extremely tight-pitch boards where space is at a premium, the following 'micro-pitch' footprints can be used (smaller pads, no silkscreen outline, etc.): _0402MP - Micro-pitch footprint for very dense/compact boards _0603MP - Micro-pitch footprint for very dense/compact boards _0805MP - Micro-pitch footprint for very dense/compact boards _1206MP - Micro-pitch footprint for very dense/compact boards
S1 = switch:320-916: TOGGLE SWITCH distributor RS Components
S2-S5 = semicon-smd-ipc:NPN-TRANSISTOR_: NPN TRANSISTOR
SJ1-SJ7 = microbuilder:SOLDERJUMPER: SMD Solder JUMPER Solder the two pads together to create a connection, or remove the solder to break it. REFLOW - Use this footprint for solder paste and reflow ovens. WAVE - Use this footprint for hand-soldering (larger pads). CLOSED - Has a trace between the two pads to ensure it is closed by default. The trace needs to be cut to disable the jumper, and can be closed again by creating a solder bridge between the two pads.
TM1 TM2 = adafruit:TRIMPOT: SMT trimmer potentiometer part number TC33X http://www.ladyada.net/library/eagle
TP4056 = ERADIONICA:DIO5158
U1 = ch340g:CH340G
U2 = NEO-6M-GPS:NEO-6M-GPS: SMD GPS Module Check prices <https://pricing.snapeda.com/parts/NEO-6M-GPS/u-blox/view-part?ref=eda>; AVAILABILITY: No availability data; DESCRIPTION: SMD GPS Module;; MF: u-blox; MP: NEO-6M-GPS; PACKAGE: None; PRICE: None
U3 = microbuilder:CCS811: CCS811 - I2C Gas and Air Quality Sensor
U4 = LM393DR:LM393DR: Check prices <https://pricing.snapeda.com/parts/LM393DR/Texas%20Instruments/view-part?ref=eda>; AVAILABILITY: In Stock; DESCRIPTION: Dual differential comparator, commercial grade 8-SOIC 0 to 70; MF: Texas Instruments; MP: LM393DR; PACKAGE: SOIC-8 Texas Instruments; PRICE: None; PURCHASE-URL: https://pricing.snapeda.com/search/part/LM393DR/?ref=eda
U5 = microbuilder:BMP180: BMP180 Digital Pressure Sensor 1.8-3.6V Supply, I2C Interface
U7 = INA226AIDGST:INA226AIDGST: Check prices <https://pricing.snapeda.com/parts/INA226AIDGST/Texas%20Instruments/view-part?ref=eda>; AVAILABILITY: In Stock; DESCRIPTION: 36V, 16-bit, ultra-precise i2c output current/voltage/power monitor w/alert 10-VSSOP -40 to 125; MF: Texas Instruments; MP: INA226AIDGST; PACKAGE: VSSOP-10 Texas Instruments; PRICE: None; PURCHASE-URL: https://pricing.snapeda.com/search/part/INA226AIDGST/?ref=eda
U8 = microbuilder:UV_VEML6070: VEML6070 - UV Light Sensor Supply: 2.7-5.5V Peak Sensitivity: 355nm Spectral Range: 320-410nm
U$1 = ESP32:ESP32-WROOM
U$4 = diy-modules:TEMP-HUM-SENSOR-DHT22: DHT22 - digital humidity & temperature sensor Also known as: AM2302 AM2302 datasheet available here: http://akizukidenshi.com/download/ds/aosong/AM2302.pdf Click here to find device on ebay.com <http://www.ebay.com/sch/dht22+digital+sensor>
U$8 = lora-lorawan-modules:HOPERF_RFM95W: HopeRF LoRaWAN modules Link: http://www.hoperf.com/rf_transceiver/lora/; HEIGHT: 1.8; LENGTH: 16; WIDTH: 16
U$11 = microsd:MICROSD-PUSH-OUT: T-Flash Push-Out Micro SD Card Reader 14.75mm x 14.5mm SMD with external pins
U$12 = lipo:DW01-P: One Cell Lithium-ion/Polymer Battery Protection IC The DW01-P battery protection IC is designed to protect lithium-ion/polymer battery from damage or degrading the lifetime due to overcharge, overdischarge, and/or overcurrent for one-cell lithium-ion/polymer battery powered systems, such as cellular phones. The ultra-small package and less required external components make it ideal to integrate the DW01-P into the limited space of battery pack. The accurate ±50mV overcharging detection voltage ensures safe and full utilization charging. The very low standby current drains little current from the cell while in storage.
XC6220B331PR-G = XC6210B332PR:XC6210B332PR: IC, LDO VOLT REG, 3V, 1A; AVAILABILITY: Good; DESCRIPTION: Ic, Linear Regulator; Max. Input, 6v; Output, 3v; 1000ma; Accuracy, 0.5%; Sot223-5; MF: Microchip; MP: MCP1826T-3002E/DC; PACKAGE: SOT-223 Microchip; PRICE: 0.59 USD

## Net classes
1 GND: width 0.4 mm
2 VCC: width 0.4 mm